# Altium schematic sheet DIAGNOSTIC_ADC.SchDoc
size A4
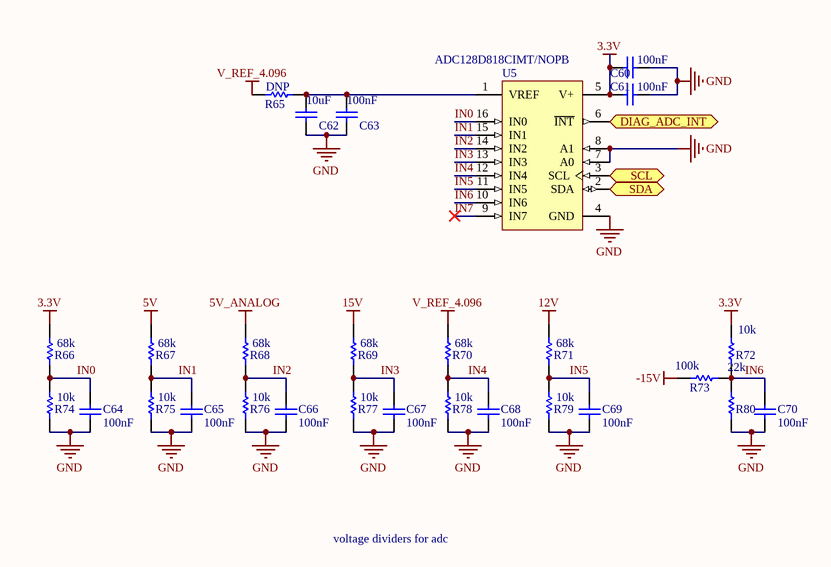
[diagram p0: DIAGNOSTIC_ADC.SchDoc]

## Parts
C60  value 100nF  [CAPC0402(1005)60_L]  (hidden comment: CAP0402)
C61  value 100nF  [CAPC0402(1005)60_L]  (hidden comment: CAP0402)
C62  value 10uF  [CAPC0805(2012)145_L]  (hidden comment: CAP0805)
C63  value 100nF  [CAPC0402(1005)60_L]  (hidden comment: CAP0402)
C64  value 100nF  [CAPC0402(1005)60_L]  (hidden comment: CAP0402)
C65  value 100nF  [CAPC0402(1005)60_L]  (hidden comment: CAP0402)
C66  value 100nF  [CAPC0402(1005)60_L]  (hidden comment: CAP0402)
C67  value 100nF  [CAPC0402(1005)60_L]  (hidden comment: CAP0402)
C68  value 100nF  [CAPC0402(1005)60_L]  (hidden comment: CAP0402)
C69  value 100nF  [CAPC0402(1005)60_L]  (hidden comment: CAP0402)
C70  value 100nF  [CAPC0402(1005)60_L]  (hidden comment: CAP0402)
R65  value DNP  [RESC0402(1005)_L]  (hidden comment: RES0402)
R66  value 68k  [RESC0402(1005)_L]  (hidden comment: RES0402)
R67  value 68k  [RESC0402(1005)_L]  (hidden comment: RES0402)
R68  value 68k  [RESC0402(1005)_L]  (hidden comment: RES0402)
R69  value 68k  [RESC0402(1005)_L]  (hidden comment: RES0402)
R70  value 68k  [RESC0402(1005)_L]  (hidden comment: RES0402)
R71  value 68k  [RESC0402(1005)_L]  (hidden comment: RES0402)
R72  value 10k  [RESC0402(1005)_L]  (hidden comment: RES0402)
R73  value 100k  [RESC0402(1005)_L]  (hidden comment: RES0402)
R74  value 10k  [RESC0402(1005)_L]  (hidden comment: RES0402)
R75  value 10k  [RESC0402(1005)_L]  (hidden comment: RES0402)
R76  value 10k  [RESC0402(1005)_L]  (hidden comment: RES0402)
R77  value 10k  [RESC0402(1005)_L]  (hidden comment: RES0402)
R78  value 10k  [RESC0402(1005)_L]  (hidden comment: RES0402)
R79  value 10k  [RESC0402(1005)_L]  (hidden comment: RES0402)
R80  value 22k  [RESC0402(1005)_L]  (hidden comment: RES0402)
U5  ADC128D818CIMT/NOPB  [MTC16_N]

## Ports
DIAG_ADC_INT (out), SCL (in), SDA (bidir)

## Nets
3.3V: C60.1 C61.1 R66.1 R72.1 U5.5(V+)
5V: R67.1
5V_ANALOG: R68.1
12V: R71.1
15V: R69.1
-15V: R73.1
GND: C60.2 C61.2 C62.1 C63.2 C64.1 C65.1 C66.1 C67.1 C68.1 C69.1 C70.1 R74.2 R75.2 R76.2 R77.2 R78.2 R79.2 R80.2 U5.4(GND) U5.7(A0) U5.8(A1)
V_REF_4.096: R65.2 R70.1
DIAG_ADC_INT: U5.6(~{INT}) ; port DIAG_ADC_INT
IN0: C64.2 R66.2 R74.1 U5.16(IN0)
IN1: C65.2 R67.2 R75.1 U5.15(IN1)
IN2: C66.2 R68.2 R76.1 U5.14(IN2)
IN3: C67.2 R69.2 R77.1 U5.13(IN3)
IN4: C68.2 R70.2 R78.1 U5.12(IN4)
IN5: C69.2 R71.2 R79.1 U5.11(IN5)
IN6: C70.2 R72.2 R73.2 R80.1 U5.10(IN6)
IN7: U5.9(IN7)
SCL: U5.3(SCL) ; port SCL
SDA: U5.2(SDA) ; port SDA
NetC62_2: C62.2 C63.1 R65.1 U5.1(VREF)

## Notes on the sheet
- voltage dividers for adc

## Library data of the parts
C60 C61 C63-C70 = CMP-1590-00004-1: 0402 (1005 Metric) Chip Capacitor; Case-EIA: 0402; Case-Metric: 1005; PackageReference: CAPC0402(1005)60
C62 = CMP-1590-00003-1: 0805 (2012 Metric) Chip Capacitor; Case-EIA: 0805; Case-Metric: 2012; PackageReference: CAPC0805(2012)145
R65-R80 = CMP-1591-00004-1: 0402 (1005 Metric) Chip Resistor; Case-EIA: 0402; Case-Metric: 1005; PackageReference: RESC0402(1005)
U5 = CMP-0054-00333-2: 12-Bit, 8-Channel, ADC System Monitor with Temperature Sensor, Internal/External Reference, and I2C Interface, 16 pin TSSOP, Pb-Free; Manufacturer: National Semiconductor; PowerWise: N; PackageTopMarking: NSUZXYTT*128D818*CIMT; CompType: ADC IC; ComponentLink3Description: MTC16 Package Page; RoHS: Y; PackageDescription: Molded TSSOP, Jedec, 5 x 4.4 x 0.9mm Body, 16 Lead, 0.65mm Pitch; PackageVersion: revD, Jun-2003; ComponentLink2Description: ADC128D818 Web Page; DatasheetVersion: Feb-2010; ComponentLink2URL: http://www.national.com/pf/AD/ADC128D818.html; ComponentLink1Description: ADC128D818 Datasheet; Code_JEDEC: MO-153-AB; PinCount: 16; PackageReference: MTC16; ComponentLink3URL: http://www.national.com/packaging/folders/mtc16.html; ComponentLink1URL: http://www.national.com/ds/AD/ADC128D818.pdf; RevisionNote: Component URLs added